# EAGLE design ISL29034_breakout (EAGLE 7.4.0)
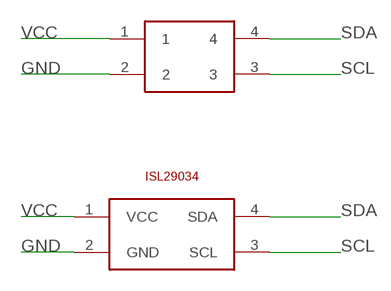
[diagram p0: schematic, sheet 1]

## Parts
IS  IN-ISL29034  [INTERSIL-ISL29034]
U$1  4PIN  [4PIN]

## Nets
GND: IS.2(GND) U$1.2
SCL: IS.3(SCL) U$1.3
SDA: IS.4(SDA) U$1.4
VCC: IS.1(VCC) U$1.1

## Library data of the parts
IS = FaBo-Mems:IN-ISL29034
U$1 = FaBo-Breakout:4PIN

## Board
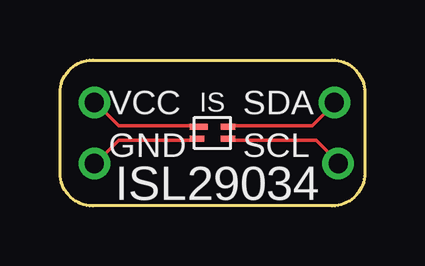
[diagram p1: board, top side]

Size 12.7 x 6.08 mm. Coordinates in mm from the lower left corner, seen from the top.
Copper layers (1*16): Top 0.035mm / dielectric 1.5mm / Bottom 0.035mm
Design rules "SeeedStudio_2layer_DRU_no_angle_20140221": minimum track width 6mil, minimum drill 12mil, track to track 6mil, track to pad 6mil, pad to pad 6mil, via to via 6mil, smd to smd 0mil, copper to edge 10mil, drill to drill 10mil, minimum pad ring 10mil, minimum via ring 6mil, stop-mask expansion 2mil, vias tented up to drill 100mil, thermal gap 10mil

### Footprints (pad centres in the part's own frame; a part is rotated, then mirrored left to right if it is on the bottom)
INTERSIL-ISL29034 = smd 0.75 x 0.25: 1 -0.575,0.25 | smd 0.6 x 0.25: 2 -0.65,-0.25; 3 0.65,-0.25; 4 0.65,0.25
4PIN = drill 0.8: 1 -4.92,1.27; 2 -4.92,-1.27; 3 5.24,-1.27; 4 5.08,1.27

### Placement (x,y rotation side)
IS  6.35,3.04 0 top
U$1  6.35,3.04 0 top

### Tracks (layer width: path | path; a pad name or v marks a point on that pad's centre or on a via)
GND
  Top 0.152: IS.2 5.64,2.73 2.44,2.73 1.52,1.82 U$1.2
SCL
  Top 0.152: IS.3 7.01,2.73 10.67,2.73 11.58,1.82 U$1.3
SDA
  Top 0.152: IS.4 7.01,3.35 10.52,3.35 11.43,4.26 U$1.4
VCC
  Top 0.152: IS.1 5.64,3.35 2.44,3.35 1.52,4.26 U$1.1

### Text on the board
tPlace: VCC | SDA | GND | SCL | ISL29034